# Altium schematic sheet 自动导轨小车.SchDoc
size A4
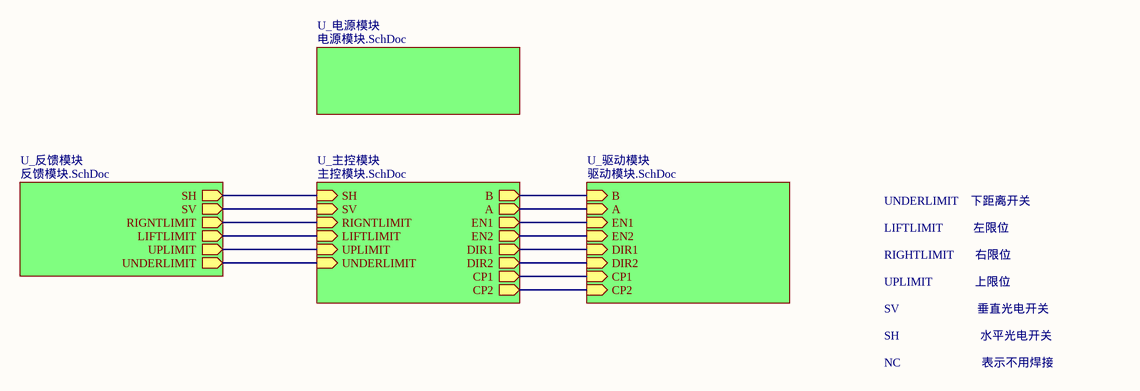
[diagram p0: 自动导轨小车.SchDoc]

## Sub-sheets
U_主控模块 = 主控模块.SchDoc: SH (in), SV (in), UNDERLIMIT (in), LIFTLIMIT (in), RIGNTLIMIT (in), UPLIMIT (in), B (out), A (out), EN1 (out), EN2 (out), DIR1 (out), DIR2 (out), CP1 (out), CP2 (out)
U_反馈模块 = 反馈模块.SchDoc: UNDERLIMIT (out), UPLIMIT (out), LIFTLIMIT (out), RIGNTLIMIT (out), SV (out), SH (out)
U_电源模块 = 电源模块.SchDoc: no entries
U_驱动模块 = 驱动模块.SchDoc: CP1 (in), CP2 (in), DIR1 (in), DIR2 (in), EN1 (in), EN2 (in), A (in), B (in)

## Nets
(unnamed): sheet U_主控模块/SH, sheet U_反馈模块/SH
(unnamed): sheet U_主控模块/SV, sheet U_反馈模块/SV
(unnamed): sheet U_主控模块/UNDERLIMIT, sheet U_反馈模块/UNDERLIMIT
(unnamed): sheet U_主控模块/LIFTLIMIT, sheet U_反馈模块/LIFTLIMIT
(unnamed): sheet U_主控模块/RIGNTLIMIT, sheet U_反馈模块/RIGNTLIMIT
(unnamed): sheet U_主控模块/UPLIMIT, sheet U_反馈模块/UPLIMIT
(unnamed): sheet U_主控模块/B, sheet U_驱动模块/B
(unnamed): sheet U_主控模块/A, sheet U_驱动模块/A
(unnamed): sheet U_主控模块/EN1, sheet U_驱动模块/EN1
(unnamed): sheet U_主控模块/EN2, sheet U_驱动模块/EN2
(unnamed): sheet U_主控模块/DIR1, sheet U_驱动模块/DIR1
(unnamed): sheet U_主控模块/DIR2, sheet U_驱动模块/DIR2
(unnamed): sheet U_主控模块/CP1, sheet U_驱动模块/CP1
(unnamed): sheet U_主控模块/CP2, sheet U_驱动模块/CP2

## Notes on the sheet
- UNDERLIMIT    下距离开关
- LIFTLIMIT          左限位
- RIGHTLIMIT       右限位
- UPLIMIT              上限位
- SV                          垂直光电开关
- SH                           水平光电开关
- NC                           表示不用焊接